# EAGLE design EEPROM (EAGLE 7.6.0)
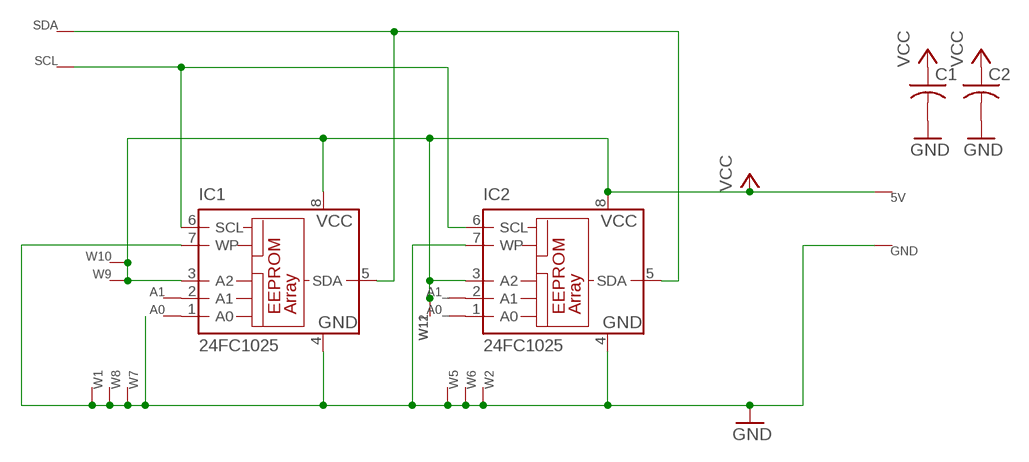
[diagram p0: schematic, sheet 1]

## Parts
5V  WIRE-VIA8  [VIA8]
A0  WIRE-VIA8  [VIA8]
A0_  WIRE-VIA8  [VIA8]
A1  WIRE-VIA8  [VIA8]
A1_  WIRE-VIA8  [VIA8]
C1  C-US-5MM  [C050-024X044]
C2  C-US-5MM  [C050-024X044]
GND  WIRE-VIA8  [VIA8]
IC1  24FC1025  24LC128P  [DIL8]
IC2  24FC1025  24LC128P  [DIL8]
SCL  WIRE-VIA8  [VIA8]
SDA  WIRE-VIA8  [VIA8]
W1  WIRE-VIA8  [VIA8]
W2  WIRE-VIA8  [VIA8]
W5  WIRE-VIA8  [VIA8]
W6  WIRE-VIA8  [VIA8]
W7  WIRE-VIA8  [VIA8]
W8  WIRE-VIA8  [VIA8]
W9  WIRE-VIA8  [VIA8]
W10  WIRE-VIA8  [VIA8]
W11  WIRE-VIA8  [VIA8]
W12  WIRE-VIA8  [VIA8]

## Nets
GND [power]: C1.2 C2.2 GND.P$1 IC1.4(GND) IC1.7(WP) IC2.4(GND) IC2.7(WP) W1.P$1 W2.P$1 W5.P$1 W6.P$1 W7.P$1 W8.P$1
N$1: A1.P$1 IC1.2(A1)
N$2: A0.P$1 IC1.1(A0)
N$3: IC1.6(SCL) IC2.6(SCL) SCL.P$1
N$4: IC1.5(SDA) IC2.5(SDA) SDA.P$1
N$5: A1_.P$1 IC2.2(A1)
N$6: A0_.P$1 IC2.1(A0)
VCC [power]: 5V.P$1 C1.1 C2.1 IC1.3(A2) IC1.8(VCC) IC2.3(A2) IC2.8(VCC) W9.P$1 W10.P$1 W11.P$1 W12.P$1

## Library data of the parts
5V A0 A0_ A1 A1_ GND SCL SDA W1 W2 W5-W12 = mylib4:WIRE: Pad for a wire offboard
C1 C2 = my-rcl:C-US: CAPACITOR, American symbol
IC1 IC2 = microchip:24*: Serial EEPROM I2C; MF: MICROCHIP; MPN: 24LC128-I/P; OC_FARNELL: 9757929; OC_NEWARK: 12C2007

## Net classes
0 default: width 0.4 mm, drill 0.5 mm, clearance 0.3 mm
1 power: width 0.8 mm, drill 0.7 mm, clearance 0.3 mm

## Board
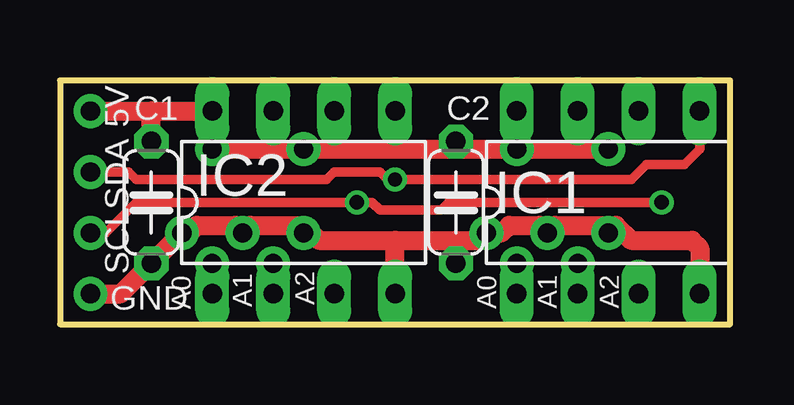
[diagram p1: board, top side]
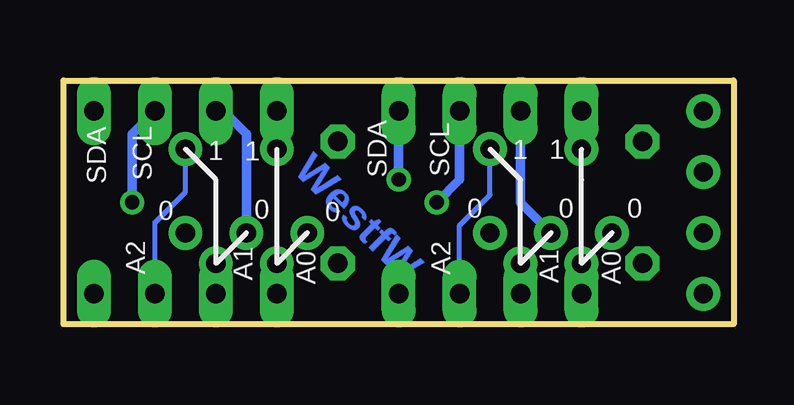
[diagram p2: board, bottom side, seen from below]

Size 27.94 x 10.16 mm. Coordinates in mm from the lower left corner, seen from the top.
Outline: 0,0 27.94,0 27.94,10.16 0,10.16 0,0
Copper layers (1*16): Top 0.035mm / dielectric 1.5mm / Bottom 0.035mm
Design rules "default *": minimum track width 10mil, minimum drill 24mil, track to track 8mil, track to pad 8mil, pad to pad 8mil, via to via 8mil, smd to smd 8mil, copper to edge 10mil, drill to drill 8mil, minimum pad ring 12mil, minimum via ring 8mil, stop-mask expansion 4mil, vias tented up to drill 0.75mm, thermal gap 10mil

### Footprints (pad centres in the part's own frame; a part is rotated, then mirrored left to right if it is on the bottom)
VIA8 = drill 0.8: P$1 0,0
C050-024X044 = drill 0.813 octagon: 1 -2.54,0; 2 2.54,0
DIL8 = drill 0.813 long: 1 -3.81,-3.81; 2 -1.27,-3.81; 3 1.27,-3.81; 4 3.81,-3.81; 5 3.81,3.81; 6 1.27,3.81; 7 -1.27,3.81; 8 -3.81,3.81

### Placement (x,y rotation side)
5V  1.27,8.89 180 top
A0  19.05,2.54 0 top
A0_  6.35,2.54 0 top
A1  21.59,2.54 0 top
A1_  8.89,2.54 0 top
C1  3.81,5.08 270 top
C2  16.51,5.08 270 top
GND  1.27,1.27 180 top
IC1  22.86,5.08 0 top
IC2  10.16,5.08 0 top
SCL  1.27,3.81 180 top
SDA  1.27,6.35 180 top
W1  10.16,3.81 0 top
W2  22.86,3.81 0 top
W5  5.08,3.81 0 top
W6  7.62,3.81 0 top
W7  17.78,3.81 0 top
W8  20.32,3.81 0 top
W9  19.05,7.3 0 top
W10  22.86,7.3 0 top
W11  10.16,7.3 0 top
W12  6.35,7.3 0 top

### Tracks (layer width: path | path; a pad name or v marks a point on that pad's centre or on a via)
GND
  Top 0.8: GND.P$1 2.54,1.27 C1.2 W5.P$1 5.4,3.81 5.71,4.13 7.3,4.13 W6.P$1 7.94,4.13 10.16,4.13 10.32,3.97 | 10.32,3.97 10.79,3.49 13.97,3.49 | 13.97,3.49 16.51,3.49 | 22.86,4.13 20.64,4.13 W8.P$1 20,4.13 18.73,4.13 18.42,3.81 W7.P$1 17.46,3.49 16.51,3.49 | 22.86,4.13 23.18,4.13 23.81,3.49 26.35,3.49 26.67,3.18 IC1.4 | IC2.4 13.97,3.49 | W1.P$1 10.32,3.97 | W2.P$1 22.86,4.13 | C2.2 16.51,3.49
  Bottom 0.4: IC2.7 8.89,5.08 W6.P$1 | IC1.7 21.27,8.89 20.32,7.94 W8.P$1
N$1
  Bottom 0.8: IC1.2 A1.P$1
N$2
  Bottom 0.8: IC1.1 A0.P$1
N$3  (via drill 0.6)
  Top 0.4: SCL.P$1 1.9,3.81 3.18,5.08 v12.38,5.08 13.02,5.08 13.33,4.76 15.87,4.76 16.19,5.08 24.13,5.08 v25.08,5.08
  Bottom 0.4: IC1.6 25.08,7.94 25.08,5.4 v25.08,5.08 | IC2.6 11.43,6.03 v12.38,5.08
N$4  (via drill 0.6)
  Top 0.4: SDA.P$1 2.86,6.35 3.18,6.03 11.11,6.03 11.43,6.35 13.33,6.35 13.65,6.03 14.29,6.03 | 14.29,6.03 23.81,6.03 24.45,6.67 26.04,6.67 26.67,7.3 IC1.5 | v13.97,6.03 14.29,6.03
  Bottom 0.4: IC2.5 v13.97,6.03
N$5
  Bottom 0.8: IC2.2 A1_.P$1
N$6
  Bottom 0.8: IC2.1 A0_.P$1
VCC
  Top 0.8: 5V.P$1 3.81,8.89 | 3.81,8.89 IC2.8 W12.P$1 7.62,7.3 8.25,7.3 9.84,7.3 W11.P$1 10.48,7.3 16.19,7.3 C2.1 16.83,7.3 W9.P$1 | C1.1 3.81,8.89 | W9.P$1 IC1.8 | W9.P$1 W10.P$1
  Bottom 0.2: IC2.3 11.43,4.13 10.16,5.4 W11.P$1 | IC1.3 24.13,4.25 22.86,5.52 W10.P$1

### Text on the board
Bottom: WestfW
tPlace: A2 | A0 | A1 | A0 | A1 | A2
bPlace: SCL | SDA | SCL | SDA | 1 | 1 | 1 | 1 | 0 | 0 | 0 | 0 | 0 | 0 | A2 | A1 | A2 | A0 | A1 | A0
_tplace: 5V | C1 | C2 | SDA | IC2 | SCL | IC1 | A2 | GND | A0 | A1 | A0 | A1 | A2
_bplace: SCL | SDA | SCL | SDA | 1 | 1 | 1 | 1 | 0 | 0 | 0 | 0 | 0 | 0 | A2 | A2 | A0 | A1 | A0 | A1